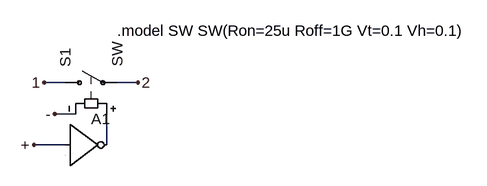
[diagram p0: schematic SPST-NC.asc]
SPST-NC.asc, the LTspice schematic file:
Version 4
SHEET 1 880 680
WIRE 128 80 96 80
WIRE 240 80 208 80
WIRE 144 128 112 128
WIRE 128 176 80 176
WIRE 192 176 192 128
FLAG 96 80 1
FLAG 240 80 2
FLAG 80 176 +
FLAG 112 128 -
SYMBOL Digital\\inv 128 112 R0
WINDOW 3 8 60 Invisible 2
SYMATTR Value td=10n Vhigh=5
SYMATTR InstName A1
SYMBOL sw 112 80 R270
SYMATTR InstName S1
TEXT 208 0 Left 2 !.model SW SW(Ron=25u Roff=1G Vt=0.1 Vh=0.1)

The netlist it stands for:
* SPST-NC.asc
A1 + 0 0 0 0 N001 0 0 BUF td=10n Vhigh=5
S1 1 2 N001 - SW
.model SW SW(Ron=25u Roff=1G Vt=0.1 Vh=0.1)
.backanno
.end